# Altium schematic sheet USB to UART.SchDoc
size 420 x 297 mm; SheetNumber: 4; SheetTotal: 7
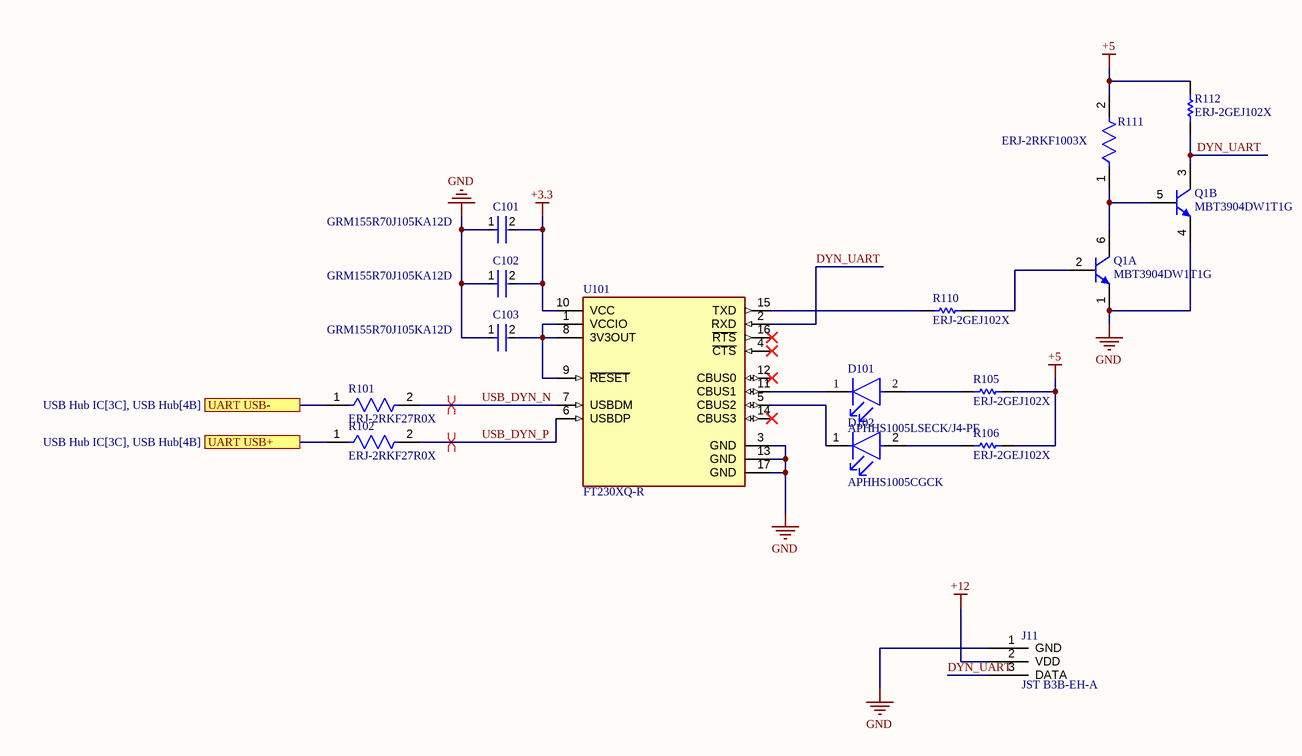
[diagram p0: USB to UART.SchDoc]

## Parts
C101  GRM155R70J105KA12D  [FP-GRM155-0_05-MFG]
C102  GRM155R70J105KA12D  [FP-GRM155-0_05-MFG]
C103  GRM155R70J105KA12D  [FP-GRM155-0_05-MFG]
D101  APHHS1005LSECK/J4-PF  [FP-APHHS1005LSECK-J4-PF-MFG]
D102  APHHS1005CGCK  [FP-APHHS1005CGCK-MFG]
J11  JST B3B-EH-A  [JST B3B-EH-A]
Q1  MBT3904DW1T1G  [ONSC-SOT-363-6-419B-02_W_V]  (parts A,B of 2)
R101  ERJ-2RKF27R0X  [FP-ERJ2R-IPC_B]
R102  ERJ-2RKF27R0X  [FP-ERJ2R-IPC_B]
R105  ERJ-2GEJ102X  [RESC1005X40X25NL05T05]
R106  ERJ-2GEJ102X  [RESC1005X40X25NL05T05]
R110  ERJ-2GEJ102X  [RESC1005X40X25NL05T05]
R111  ERJ-2RKF1003X  [FP-ERJ2RK-IPC_C]
R112  ERJ-2GEJ102X  [RESC1005X40X25NL05T05]
U101  FT230XQ-R  [FP-QFN-16-MFG]

## Ports
UART USB+ (see USB Hub IC[3C], USB Hub[4B]), UART USB- (see USB Hub IC[3C], USB Hub[4B])

## Nets
+3.3: C101.2 C102.2 U101.10(VCC)
+5: R105.2 R106.2 R111.2 R112.2
+12: J11.2(VDD)
GND: C101.1 C102.1 C103.1 J11.1(GND) Q1.1(E) Q1.4(E) U101.3(GND) U101.13(GND) U101.17(GND)
DYN_UART: J11.3(DATA) Q1.3(C) R112.1 U101.2(RXD)
UART USB+: R102.1 ; port UART USB+
UART USB-: R101.1 ; port UART USB-
USB_DYN_N: R101.2 U101.7(USBDM)
USB_DYN_P: R102.2 U101.6(USBDP)
NetC103_2: C103.2 U101.1(VCCIO) U101.8(3V3OUT) U101.9(~{RESET})
NetD101_1: D101.1(C) U101.11(CBUS1)
NetD101_2: D101.2(A) R105.1
NetD102_1: D102.1(C) U101.5(CBUS2)
NetD102_2: D102.2(A) R106.1
NetQ1_2: Q1.2(B) R110.2
NetQ1_5: Q1.5(B) Q1.6(C) R111.1
NetR110_1: R110.1 U101.15(TXD)

Not connected (* = marked no-connect by the designer): U101 4(~{CTS})* 12(CBUS0)* 14(CBUS3)* 16(~{RTS})*

## Layout directives
differential pair: USB_DYN_N, USB_DYN_P

## Notes on the sheet
- CREATIVE COMMONS
- PUBLIC LICENSE:
- BARKOUR ROBOT
- CC BY-NC 4.0
- APPROVED
- DWG NO
- GOOGLE LLC
- FILE
- RELEASED
- 2024/05/09
- SIZE
- 1600 AMPHITHEATRE PARKWAY
- MOUNTAIN VIEW CA 94043
- A3
- SHEET
- OF
- THIS DESIGN IS BEING PROVIDED  FOR NON-COMMERCIAL USE ONLY. THE USE OF =SCIENTIST_NAME_POSSESSIVE NAME IN CONNECTION WITH THE DESIGN IS NOT INTENDED TO IMPLY THAT =SCIENTIST_NAME SPONSORS OR ENDORSES THE DESIGN, GOOGLE LLC, OR ANY OF GOOGLE LLC'S PRODUCTS OR SERVICES.

## Library data of the parts
C101-C103 = CMP-2008-04587-2: Chip Multilayer Ceramic Capacitors for General Purpose, 0402, 1.0uF, X7R, 15%, 10%, 6.3V; Capacitance: 1uF; Case Code (Metric): 1005; Min Operating Temperature: -55°C; Tolerance: 10%; Depth: 0.5mm; Max Operating Temperature: 125°C; Width: 0.5mm; Case Code (Imperial): 0402; Termination: SMD/SMT; Weight: 0.000212oz; Thickness: 0.022inch; Package Quantity: 10000; Packaging: Tape and Reel; Voltage Rating: 6.3V; Lead Free: Lead Free; Height: 0.5mm; Length: 1mm; Dielectric: X7R; Case/Package: 0402; Voltage Rating (DC): 6.3V; Material: Ceramic; Mount: Surface Mount
D101 = CMP-00682-82290958-1: APHHS1005LSECK/J4-PF LED Uni-Color SB. Orange 611nm 2-Pin SMD T/R; Forward Voltage: 1.8V; Reverse Voltage: 5V; Forward Current: 2mA; Viewing Angle: 120°; Max Junction Temperature (Tj): 115°C; Luminous Intensity: 40mcd; Wavelength: 605nm; Power Dissipation: 84mW; Min Operating Temperature: -40°C; Case/Package: 0402; RoHS: Non-Compliant; Max Operating Temperature: 85°C; Schedule B: 8541402000, 8541402000; NexarPartId: 82290958; Height: 600µm; Color: Orange
D102 = CMP-44529-000044-1: LED GREEN CLEAR CHIP SMD; Viewing Angle: 120°; Dominant Wavelength: 570nm; Test Current: 20mA; Luminous Intensity: 50mcd; Forward Voltage: 2.1V; Number of LEDs: 1; Lens Color: Clear; Packaging: Tape and Reel; Max Operating Temperature: 85°C; Illumination Color: Green; Length: 1mm; Mount: Surface Mount; Lens Style: Clear; Color: Green; Number of Pins: 2; Wavelength: 570nm; Case/Package: 0402; Width: 0.5mm; Package Quantity: 2000; Case Code (Metric): 1005; Height: 0.6mm; Lead Free: Lead Free; Case Code (Imperial): 0402; Forward Current: 20mA; Min Operating Temperature: -40°C
Q1 = CMP-1048-00877-1: Dual General Purpose Transistors, 6-Pin SOT-363, Pb-Free, Tape and Reel; Manufacturer: On Semiconductor; Polarity: Dual NPN; fT Min (MHz): 300; IC Continuous (A): 0.2; DatasheetVersion: Rev. 9; ComponentLink2Description: Datasheet; Mounting Technology: Surface Mount; PackageReference: SOT-363-6-419B-02_W; RoHS: TRUE; ComponentLink1Description: Manufacturer URL; ComponentLink2URL: http://www.onsemi.com/pub_link/Collateral/MBT3904DW1T1-D.PDF; PackageVersion: Rev. W, 01/2006; Packing: Tape and Reel; PartNumber: MBT3904DW1T1G; ComponentLink1URL: http://www.onsemi.com/; ComponentLink3URL: http://www.onsemi.com/pub_link/Collateral/NTJD4001N-D.PDF; ComponentLink3Description: Package Specification; PackageDescription: 6-Pin Small Outline Transistor, Body 2 x 1.25 mm, Pitch 0.65 mm
R101 R102 = CMP-2002-00830-2: RES SMD 27 OHM 1% 1/10W 0402; Voltage Rating: 50V; Temperature Coefficient: 100ppm/°C; Resistance: 27R; Power Rating: 100mW; Military Standard: Not; Construction: Rectangular; Tolerance: 1%; Features: Automotive AEC-Q200; Length: 1mm; Lead Free: Lead Free; Mount: Surface Mount; Number of Terminations: 2; Radiation Hardening: No; Number of Pins: 2; Width: 0.5mm; Contact Plating: Tin; Voltage Rating (DC): 50V; Resistance Tolerance: 1%; Series: ERJ; Packaging: Tape and Reel; Case/Package: 0402; Technology: THICK FILM; REACH SVHC: No SVHC; Depth: 0.5mm; Resistor Type: Thick Film; Package Quantity: 1; Termination: SMD/SMT; Case Code (Imperial): 0402; Height: 0.35mm; Weight: 2.8E-05oz; Max Operating Temperature: 155°C; Case Code (Metric): 1005; Min Operating Temperature: -55°C; RoHS Compliant: Yes; Max Power Dissipation: 100mW
R105 R106 R110 R112 = CMP-2002-00432-1: Manufacturer: Panasonic; Part Number: ERJ-2GEJ102X
R111 = CMP-2002-00608-4: RES SMD 100K OHM 1% 1/10W 0402; Resistance: 100kR; Voltage Rating (DC): 50V; Power Rating: 100mW; Temperature Coefficient: 100ppm/°C; Case/Package: 0402; Length: 1mm; Package Quantity: 1; Radiation Hardening: No; Case Code (Metric): 1005; Contact Plating: Tin; Mount: Surface Mount; Depth: 0.5mm; Max Operating Temperature: 155°C; Lead Free: Lead Free; Width: 0.5mm; Composition: Thick Film; Case Code (Imperial): 0402; Tolerance: 1%; Termination: SMD/SMT; Number of Pins: 2; Height: 0.35mm; Voltage Rating: 50V; Military Standard: Not; REACH SVHC: No SVHC; Packaging: Tape and Reel; Min Operating Temperature: -55°C; Max Power Dissipation: 100mW; Features: Automotive AEC-Q200; Number of Terminations: 2
U101 = CMP-0248-00010-3: IC USB SERIAL BASIC UART 16QFN; Number of Channels: 1; Data Rate: 12Mbps; Operating Supply Current: 8mA; Max Supply Voltage: 5.5V; Operating Supply Voltage: 5V; Min Supply Voltage: 2.97V; Width: 4mm; Length: 4mm; Height: 0.75mm; Max Operating Temperature: 85°C; Interface: USB; Min Operating Temperature: -40°C; Package Quantity: 5000; Lead Free: Lead Free; Number of Pins: 16; Case/Package: QFN; Weight: 0.002014oz; Packaging: Tape and Reel; Mount: Surface Mount